# Altium schematic sheet power.SchDoc
size A4; DocumentNumber: 5; SheetNumber: 5; SheetTotal: 24; SheetDescription: Decoupling and references for MCU0; ClassName: ISO_MCU
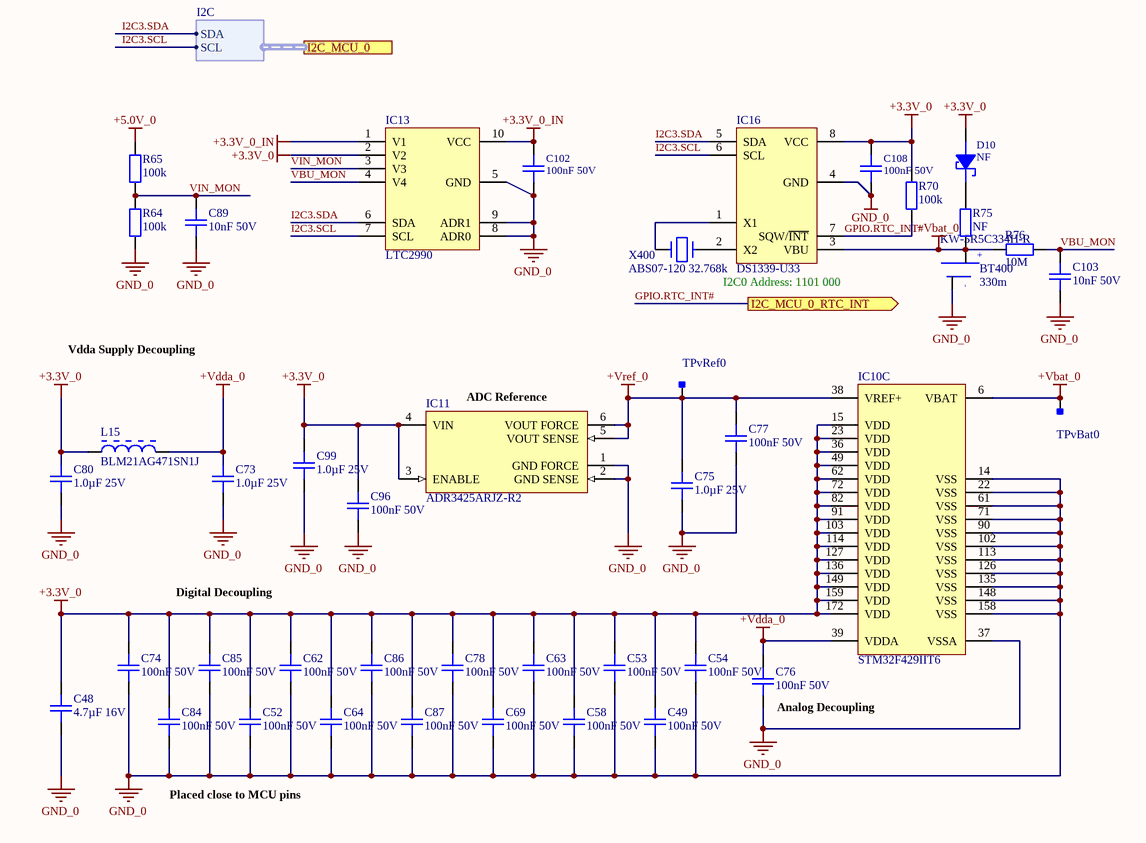
[diagram p0: power.SchDoc]

## Parts
BT400  330m  Supplier Part Number 1: KW-5R5C334H-R  [KW-5R5C]
C48  4.7µF 16V  [0805C]
C49  100nF 50V  [0402C]
C52  100nF 50V  [0402C]
C53  100nF 50V  [0402C]
C54  100nF 50V  [0402C]
C58  100nF 50V  [0402C]
C62  100nF 50V  [0402C]
C63  100nF 50V  [0402C]
C64  100nF 50V  [0402C]
C69  100nF 50V  [0402C]
C73  1.0µF 25V  [0603C]
C74  100nF 50V  [0402C]
C75  1.0µF 25V  [0603C]
C76  100nF 50V  [0402C]
C77  100nF 50V  [0402C]
C78  100nF 50V  [0402C]
C80  1.0µF 25V  [0603C]
C84  100nF 50V  [0402C]
C85  100nF 50V  [0402C]
C86  100nF 50V  [0402C]
C87  100nF 50V  [0402C]
C89  10nF 50V  [0603C]
C96  100nF 50V  [0603C]
C99  1.0µF 25V  [0603C]
C102  100nF 50V  [0603C]
C103  10nF 50V  [0603C]
C108  100nF 50V  [0603C]
D10  NF  [NF_SOD-523]
IC10  STM32F429IIT6  [STM-LQFP176_N]  (part C of 3)
IC11  ADR3425ARJZ-R2  [ADI-RJ-6_N]
IC13  LTC2990  [MSOP-10]
IC16  DS1339-U33  [USOP-8]
L15  BLM21AG471SN1J  [MURA-BLM21-H1-CHIP-2_V]
R64  100k  [0603R]
R65  100k  [0603R]
R70  100k  [0603R]
R75  NF  [0603R]
R76  10M  [0603R]
TPvBat0  Testpoint_Square  [Testpoint_S1]  (value not drawn)  (no BOM)
TPvRef0  Testpoint_Square  [Testpoint_S1]  (value not drawn)  (no BOM)
X400  ABS07-120 32.768k  [ABS07]

## Ports
I2C_MCU_0 (harness I2C), I2C_MCU_0_RTC_INT (out)

## Harnesses
I2C: SDA, SCL

## Nets
+3.3V_0: C48.1 C49.1 C52.1 C53.1 C54.1 C58.1 C62.1 C63.1 C64.1 C69.1 C74.1 C78.1 C80.1 C84.1 C85.1 C86.1 C87.1 C96.1 C99.1 C108.1 D10.1(A) IC10.15(VDD) IC10.23(VDD) IC10.36(VDD) IC10.49(VDD) IC10.62(VDD) IC10.72(VDD) IC10.82(VDD) IC10.91(VDD) IC10.103(VDD) IC10.114(VDD) IC10.127(VDD) IC10.136(VDD) IC10.149(VDD) IC10.159(VDD) IC10.172(VDD) IC11.3(ENABLE) IC11.4(VIN) IC13.2(V2) IC16.8(VCC) L15.1 R70.2
+3.3V_0_IN: C102.1 IC13.1(V1) IC13.10(VCC)
+5.0V_0: R65.2
+Vbat_0: BT400.1(pos1) IC10.6(VBAT) IC16.3(VBU) R75.2 R76.2 TPvBat0.1
+Vdda_0: C73.1 C76.1 IC10.39(VDDA) L15.2
+Vref_0: C75.1 C77.1 IC10.38(VREF+) IC11.5(VOUT_SENSE) IC11.6(VOUT_FORCE) TPvRef0.1
GND_0: BT400.2(neg) C48.2 C49.2 C52.2 C53.2 C54.2 C58.2 C62.2 C63.2 C64.2 C69.2 C73.2 C74.2 C75.2 C76.2 C77.2 C78.2 C80.2 C84.2 C85.2 C86.2 C87.2 C89.1 C96.2 C99.2 C102.2 C103.1 C108.2 IC10.14(VSS) IC10.22(VSS) IC10.37(VSSA) IC10.61(VSS) IC10.71(VSS) IC10.90(VSS) IC10.102(VSS) IC10.113(VSS) IC10.126(VSS) IC10.135(VSS) IC10.148(VSS) IC10.158(VSS) IC11.1(GND_FORCE) IC11.2(GND_SENSE) IC13.5(GND) IC13.8(ADR0) IC13.9(ADR1) IC16.4(GND) R64.1
GPIO.RTC_INT#: IC16.7(SQW/~{INT}) R70.1 ; port I2C_MCU_0_RTC_INT
I2C3.SCL: IC13.7(SCL) IC16.6(SCL) ; port I2C_MCU_0.SCL
I2C3.SDA: IC13.6(SDA) IC16.5(SDA) ; port I2C_MCU_0.SDA
VBU_MON: C103.2 IC13.4(V4) R76.1
VIN_MON: C89.2 IC13.3(V3) R64.2 R65.1
NetD10_2: D10.2(C) R75.1
NetIC16_1: IC16.1(X1) X400.2
NetIC16_2: IC16.2(X2) X400.1

## Notes on the sheet
- I2C0 Address: 1101 000
- Vdda Supply Decoupling
- (near IC11) ADC Reference
- Digital Decoupling
- (near C76) Analog Decoupling
- Placed close to MCU pins
- Title
- Size:
- Date:
- Tabloid
- Number:
- Time:
- Revision:
- Sheet
- of
- File:
- (in symbol BATTERY_1) +; -

## Library data of the parts
BT400 = BATTERY_1: Eaton 330mF, 5.5v, -20 to +80, Ultracapacitor, KW-5R5C334H-R; Manufacturer 1: Eaton - Electronics Division; DBDesc: 330m 5.5V super capacitor -40-+85degC 13.5mm 8.5mm tall, RoHS compliant (DUPLICATE OF ID#22645); ID: 27713; Capacitance: 330mF; Manufacturer Part Number 1: KW-5R5C334H-R; Supplier 1: Avnet; Stock 1: 0; Pricing 1: 400=2.49000, 800=2.39000, 1600=2.29000, 2400=2.29000, 4000=2.19000 (USD); RoHS: No
C48 = gen_C_ceramic_4u7_16V_X7R_0805: Ceramic, 4.7µF, ±10%, 16V, X7R, –55 to 125°C, 0805 (2012),RoHS, Automotive; Part Number: GCJ21BR71C475KA01; Manufacturer: Murata; Capacitance: 4u7; Case EIA: 0805; Case Metric: 2012; AVT Set: x; Automotive Qualified: True; PnP Package: C_0805_10; PnP Value: 4.7µF/16V/X7R; Rated Voltage: 16V; Dielectric: X7R; Supplier 1: Digi-Key; Supplier Part Number 1: 490-10557-1-ND; Height - Seated (Max): 1.25mm; Mounting Type: SurfaceMount,MLCC; Operating Temperature: –55 to 125°C; Series: GCJ; Tolerance: ±10%; Manufacturer_Part_Number: GCJ21BR71C475KA01
C49 C52-C54 C58 C62-C64 C69 C74 C76-C78 C84-C87 = gen_C_ceramic_100n_50V_X7R_0402: Ceramic, 100nF, ±10%, 50V, X7R, –55 to 125°C, 0402 (1005),RoHS, Automotive; Part Number: GCM155R71H104KE02; Manufacturer: Murata; Capacitance: 100n; Case EIA: 0402; Case Metric: 1005; PnP Package: C_0402_10; PnP Value: 100nF/50V/X7R; Automotive Qualified: True; PnP equipped: x; Rated Voltage: 50V; Dielectric: X7R; Supplier 1: Digi-Key; Supplier Part Number 1: 490-10672-1-ND; Height - Seated (Max): 0.5mm; Mounting Type: SurfaceMount,MLCC; Operating Temperature: –55 to 125°C; Series: GCM; Tolerance: ±10%; Manufacturer_Part_Number: GCM155R71H104KE02
C73 C75 C80 C99 = gen_C_ceramic_1u_25V_X7R_0603: Ceramic, 1.0µF, ±10%, 25V, X7R, –55 to 125°C, 0603 (1608),RoHS, Automotive; Part Number: GCJ188R71E105KA01; Manufacturer: Murata; Capacitance: 1µF; Case EIA: 0603; Case Metric: 1608; PnP Package: C_0603_10; PnP Value: 1.0µF/25V/X7R; Automotive Qualified: True; Rated Voltage: 25V; Dielectric: X7R; Supplier 1: Digi-Key; Supplier Part Number 1: 490-14409-1-ND; Height - Seated (Max): 0.8mm; Mounting Type: SurfaceMount,MLCC; Operating Temperature: –55 to 125°C; Series: GCJ; Tolerance: ±10%; Manufacturer_Part_Number: GCJ188R71E105KA01
C89 C103 = gen_C_ceramic_10n_50V_X7R_0603: Ceramic, 10nF, ±10%, 50V, X7R, –55 to 125°C, 0603 (1608),RoHS, Automotive; Part Number: GCJ188R71H102KA01; Manufacturer: Murata; Case EIA: 0603; Case Metric: 1608; Capacitance: 10n; Automotive Qualified: True; PnP Package: C_0603_10; PnP Value: 10nF/50V/X7R; Dielectric: X7R; Rated Voltage: 50V; Height - Seated (Max): 0.8mm; Mounting Type: SurfaceMount,MLCC; Operating Temperature: –55 to 125°C; Series: GCJ; Tolerance: ±10%; Manufacturer_Part_Number: GCJ188R71H102KA01; Supplier 1: Digi-Key; Supplier Part Number 1: 490-5768-1-ND
C96 = gen_C_ceramic_100n_50V_X7R_0603: Ceramic, 100nF, ±10%, 50V, X7R, –55 to 125°C, 0603 (1608),RoHS, Automotive; Part Number: GCJ188R71H104KA12; Manufacturer: Murata; Capacitance: 100n; Case EIA: 0603; Case Metric: 1608; PnP Package: C_0603_10; PnP Value: 100nF/50V/X7R; PnP equipped: x; Automotive Qualified: True; Rated Voltage: 50V; Dielectric: X7R; Supplier 1: Digi-Key; Supplier Part Number 1: 490-5798-1-ND; Height - Seated (Max): 0.8mm; Mounting Type: SurfaceMount,MLCC; Operating Temperature: –55 to 125°C; Series: GCJ; Tolerance: ±10%; Manufacturer_Part_Number: GCJ188R71H104KA12
C102 C108 = gen_C_ceramic_100n_50V_X7R_0603: Ceramic, 100nF, ±10%, 50V, X7R, –55 to 125°C, 0603 (1608),RoHS, Automotive; Part Number: GCJ188R71H104KA12; Manufacturer: Murata; Capacitance: 100n; Case EIA: 0603; Case Metric: 1608; Automotive Qualified: True; PnP Package: C_0603_10; PnP Value: 100nF/50V/X7R; Dielectric: X7R; Rated Voltage: 50V; Height - Seated (Max): 0.8mm; Mounting Type: SurfaceMount,MLCC; Operating Temperature: –55 to 125°C; Series: GCJ; Tolerance: ±10%; Manufacturer_Part_Number: GCJ188R71H104KA12; Supplier 1: Digi-Key; Supplier Part Number 1: 490-5798-1-ND
D10 = DIODE_SCHTKY: '''BAT41 Schottky diode, small signal''' / - If(avg) = 200mA, Vf(max) = 1V@200mA / - Vr(max) = 100V, Ir = 100nA@50V, 25deg / - SOD-523 package, RoHS compliant; DBDesc: do not populate, RoHS compliant; ID: 908; Preffered ID: 20995
IC10 = MC-ARM-STM32F4X9-SQ176: ARM Cortex-M4 32-bit MCU+FPU, 225 DMIPS, 2048 kB Flash, 256 kB Internal RAM, 140 I/Os, 176-pin LQFP, -40 to 85 degC, Tray; Manufacturer: STMicroelectronics; Internal RAM Size (kB): 256; I/Os (High Current): 140; FLASH Size (Prog) (kB): 2048; D/A Converter: 2x12-bit; Supply Voltage(Vcc) max (V): 3.6; Operating Frequency(F) (Processor speed) (MHz): 180; Supply Voltage(Vcc) min (V): 1.8; Core: ARM Cortex-M4; PackageReference: LQFP176; ComponentLink1Description: Manufacturer URL; Packing: Tray; ComponentLink2Description: Datasheet; ComponentLink3Description: Package Specification; ComponentLink2URL: http://www.st.com/st-web-ui/static/active/en/resource/technical/document/data_brief/DM00053488.pdf; PackageVersion: Rev. 4, 06/2013; ComponentLink1URL: http://www.st.com/web/en/home.html; DatasheetVersion: Rev. 2; PartNumber: STM32F429IIT6; PackageDescription: 176-Pin Low Profile Quad Flat Package, 24 x 24 mm Body, 0.5 mm Pitch; ComponentLink3URL: http://www.st.com/st-web-ui/static/active/en/resource/technical/document/datasheet/DM00035129.pdf; Mounting Technology: Surface Mount; Part Number: STM32F429IIT6
IC11 = CMP-0784-00366-1: Micropower, High Accuracy Voltage Reference, 2.5 V Output, 2.7 to 5.5 V Supply, Industrial, 6-pin SOT23 (RJ-6), Reel; Manufacturer: Analog Devices; Vout: 2.5V; Ref Out TC (ppm/C): 2.5; Min V Supply (V): 2.7; Max V Supply (V): 5.5; ComponentLink3URL: http://www.analog.com/static/imported-files/packages/PKG_PDF/SOT-23(RJ)/RJ_6.pdf; Mounting Technology: Surface Mount; Packing: Reel; ComponentLink3Description: Package Specification; Code_JEDEC: MO-178-AB; PackageReference: RJ-6; Operating Temp Range: -40 to 125 degC; PartNumber: ADR3425ARJZ-R2; ComponentLink2Description: Datasheet; PackageDescription: 6-Pin Small Outline Transistor Package, Body 2.9 x 1.6 mm, Pitch 0.95 mm; ComponentLink1URL: http://www.analog.com/en/index.html; ComponentLink2URL: http://www.analog.com/static/imported-files/data_sheets/ADR3412_ADR3420_ADR3425_ADR3430_ADR3433_ADR3440_ADR3450.pdf; ComponentLink1Description: Manufacturer URL; PackageVersion: 121608-A, 12/2008; ComponentLink4URL: Product URL:http://www.analog.com/en/special-linear-functions/voltage-references/adr3425/products/product.html; ComponentLink4Description: URL Link1; DatasheetVersion: Rev. B; Part Number: ADR3425ARJZ-R2
IC13 = LTC2990: ID: 19355; DBDesc: Linear LTC2990IMS quad I2C voltage, current and temperature monitor, -40°C to +85°C, 10-pin MSOP, RoHS compliant; Part Number: LTC2990
IC16 = DS1339-U33: DBDesc: DS1339U-33+ RTC I2C w/alarm USOP-8, RoHS compliant; ID: 11376; Part Number: DS1339-U33
L15 = CMP-0686-00649-2: Chip Ferrite Bead for General Signal lines, 470 Ohm, 700 mA, -55 to 125 degC, 2 x 1.25 x 1.05 mm SMD, Tape and Reel; Manufacturer: Murata; DC Resistance: 0.19 Ohm Max.; Impedance (at 100 MHz): 470 Ohm +/- 25%; Rated Current: 700 mA; ComponentLink1URL: http://www.murata.com/; Packing: Tape and Reel; PackageDescription: 2-Pin Chip, Body 2 x 1.25 mm; ComponentLink3Description: Package Specification; Operating Temperature Range: -55 to 125 degC; ComponentLink1Description: Manufacturer URL; PartNumber: BLM21AG471SN1J; DatasheetVersion: 08/2013; Mounting Technology: Surface Mount; ComponentLink2URL: http://www.murata.com/products/catalog/pdf/c31e.pdf; ComponentLink3URL: http://www.murata.com/products/catalog/pdf/c31e.pdf; ComponentLink2Description: Datasheet; PackageReference: BLM21_H1050-2; Part Number: BLM21AG471SN1J
R64 R65 R70 = gen_R_100k_0603: SMD Resistor 100k 0603; Case EIA: 0603; Case Metric: 1608; PnP Package: R_0603; Automotive Qualified: False; Operating Temperature: -55°C - +155°C; PnP Value: 100k; Part Number: gen_R_100k_0603
R75 = gen_R_NF_0603: SMD Resistor NF 0603; Case EIA: 0603; Case Metric: 1608; PnP Package: R_0603; Automotive Qualified: False; Operating Temperature: -55°C - +155°C; Part Number: gen_R_NF_0603; PnP Value: NF
R76 = gen_R_10M_0603: SMD Resistor 10M 0603; Part Number: gen_R_10Meg_0603; Case EIA: 0603; Case Metric: 1608; PnP Package: R_0603; PnP Value: 10Meg; Automotive Qualified: False; Operating Temperature: -55°C - +155°C
TPvBat0 TPvRef0 = Testpoint_Square: Testpoint, square; Part Number: Testpoint_Square
X400 = CRYSTAL1: ID: 22914; DBDesc: 32.768kHz ABS07-120, 20ppm, 6pF load, 60k ESR, 3.2x1.5mm crystal, RoHS compliant